# Altium schematic sheet mechanics.SchDoc: Stabilizer Piezo Driver
size 420 x 297 mm; CheckedBy: G. Kasprowicz; Author: Jakub Kajzer; CompanyName: WUT ISE; DrawnBy: Jakub Kajzer; Organization: WUT ISE; Address1: PW ISE; Address2: Nowowiejska 15/19 00-665 Warsaw; Address3: gkasprow@gmail.com; DocumentNumber: 7; Revision: 2; SheetNumber: 7; SheetTotal: 7; ModifiedBy: -; CreateDate: 03.08.2020; CheckedDate: -; Title2: mechanics; DivGrp: WUT ISE; Designer: Jakub Kajzer; ModifiedDate: -; ProjectName: Sensor Box
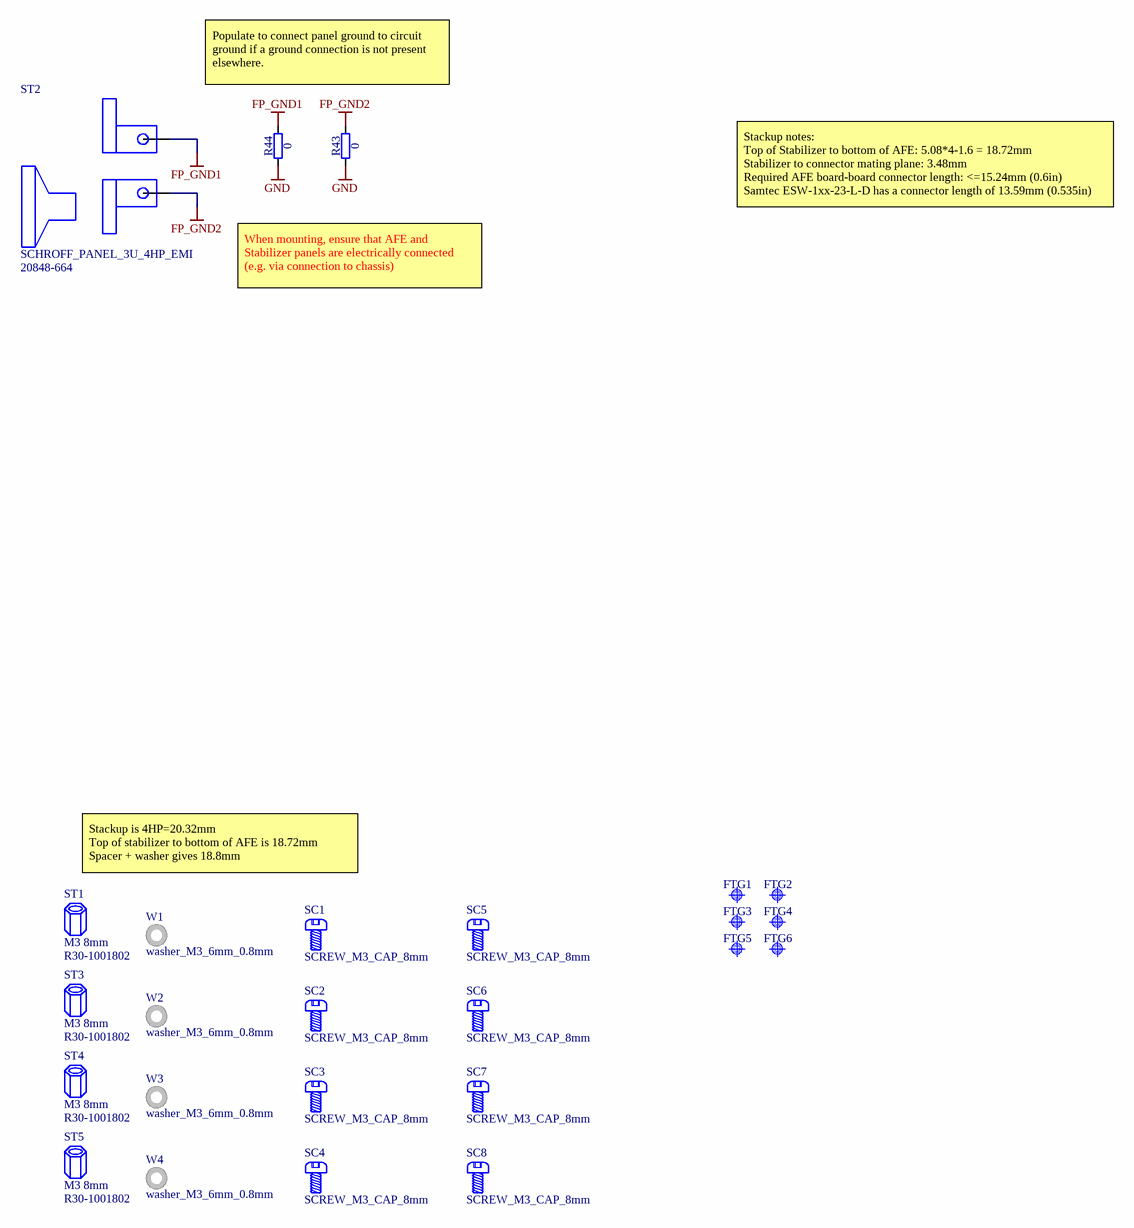
[diagram p0: mechanics.SchDoc]

## Parts
FTG1  Use only in PCB  [FIDUCIAL_TOP_C100-200]  (value not drawn)
FTG2  Use only in PCB  [FIDUCIAL_TOP_C100-200]  (value not drawn)
FTG3  Use only in PCB  [FIDUCIAL_TOP_C100-200]  (value not drawn)
FTG4  Use only in PCB  [FIDUCIAL_TOP_C100-200]  (value not drawn)
FTG5  Use only in PCB  [FIDUCIAL_TOP_C100-200]  (value not drawn)
FTG6  Use only in PCB  [FIDUCIAL_TOP_C100-200]  (value not drawn)
R43  0  [RESC1608X55N]
R44  0  [RESC1608X55N]
SC1  SCREW_M3_CAP_8mm  [SCREW_M3_CAP_8mm]
SC2  SCREW_M3_CAP_8mm  [SCREW_M3_CAP_8mm]
SC3  SCREW_M3_CAP_8mm  [SCREW_M3_CAP_8mm]
SC4  SCREW_M3_CAP_8mm  [SCREW_M3_CAP_8mm]
SC5  SCREW_M3_CAP_8mm  [SCREW_M3_CAP_8mm]
SC6  SCREW_M3_CAP_8mm  [SCREW_M3_CAP_8mm]
SC7  SCREW_M3_CAP_8mm  [SCREW_M3_CAP_8mm]
SC8  SCREW_M3_CAP_8mm  [SCREW_M3_CAP_8mm]
ST1  M3 8mm  [R30-1001802]
ST2  SCHROFF_PANEL_3U_4HP_EMI  Manufacturer Part Number: 20848-664  [SCHROFF_PANEL_3HP_4U]
ST3  M3 8mm  [R30-1001802]
ST4  M3 8mm  [R30-1001802]
ST5  M3 8mm  [R30-1001802]
W1  washer_M3_6mm_0.8mm  [washer_M3_6mm_0.8mm]
W2  washer_M3_6mm_0.8mm  [washer_M3_6mm_0.8mm]
W3  washer_M3_6mm_0.8mm  [washer_M3_6mm_0.8mm]
W4  washer_M3_6mm_0.8mm  [washer_M3_6mm_0.8mm]

## Nets
FP_GND1: R44.2 ST2.1
FP_GND2: R43.2 ST2.0
GND: R43.1 R44.1

## Notes on the sheet
- Populate to connect panel ground to circuit ground if a ground connection is not present elsewhere.
- Stackup notes:
  Top of Stabilizer to bottom of AFE: 5.08*4-1.6 = 18.72mm
  Stabilizer to connector mating plane: 3.48mm
  Required AFE board-board connector length: <=15.24mm (0.6in)
  Samtec ESW-1xx-23-L-D has a connector length of 13.59mm (0.535in)
- When mounting, ensure that AFE and Stabilizer panels are electrically connected (e.g. via connection to chassis)
- Stackup is 4HP=20.32mm
  Top of stabilizer to bottom of AFE is 18.72mm
  Spacer + washer gives 18.8mm
- Project/Equipment
- Document
- Designer
- Drawn by
- Check.by
- Copyright WUT ISE 2018.
  This documentation describes Open Hardware and is licensed under the CERN OHL v.1.1. You may redistribute and modify this documentation under the terms of the CERN OHL v.1.1. (http://ohwr.org/CERNOHL). This documentation is distributed WITHOUT ANY EXPRESS OR IMPLIED WARRANTY, INCLUDING OF MERCHANTABILITY, SATISFACTORY QUALITY AND FITNESS FOR A PARTICULAR PURPOSE. Please see the CERN OHL v.1.1 for applicable conditions.
- Contact
- File
- Last Mod.
- Print Date
- Sheet
- Size
- A3
- of
- Rev

## Library data of the parts
FTG1-FTG6 = FIDUCIAL_TARGET_C100-200: Fiducial Target; Part Description: Round Fiducial Target, Top Layer, 1.0mm, Top Solder 2.0mm, Keepout =2.0mm; Mounted: No; Part Number: FIDUCIAL_TARGET_C100-200; Component Kind: Standard (No BOM); Component Type: Standard (No BOM); Pin Count: 1; Family: Fiducial; Socket: No; SMD: Yes; Sense: No; Status: None; ComponentHeight: 0mm; HelpURL: Undefined; Author: CERN DEM JLC; CreateDate: 09/02/2010; LatestRevisionDate: 04/04/2012; PackageDescription: Round Fiducial Target, Top Layer, 1.0mm, Top Solder 2.0mm, Keepout =2.0mm
R43 R44 = R0603_0R_JUMPER: Resistor; Part Description: 1A (0.05R Max DC Resistance) Zero Ohm Jumper; Manufacturer: GENERIC; Manufacturer1 Part Number: NRC06Z0; PressFit: No; Part Number: R0603_0R_JUMPER; Component Kind: Standard; Component Type: Standard; Pin Count: 2; Value: 0; Status: Preferred; Manufacturer Part Number: R0603_0R_JUMPER; Case: 0603; Mounted: Yes; Sense: No; Socket: No; SMD: Yes; Manufacturer1 Example: NIC COMPONENT; Manufacturer1 ComponentHeight: 0.55mm; HelpURL: \\cern.ch\dfs\Applications\Altium\Datasheets\R0603_NIC_NRC.pdf; Author: CERN DEM JLC; CreateDate: 03/12/2007; LatestRevisionDate: 13/03/2008
SC1-SC8 = SCREW_M3_CAP_8mm: M3 x 8mm cap head screw; Manufacturer: Accu Limited; Manufacturer Part Number: SSCF-M3-8-12.9-Z
ST1 ST3-ST5 = STANDOFF_HARWIN_R30_1001802: M3.0x18 standoff; Manufacturer: Harwin; Manufacturer Part Number: R30-1001802
ST2 = SCHROFF_PANEL_3U_4HP_EMI: Schroff 3HP 4U EUROCARD Panel with EMI gaskets kit; Manufacturer: Schroff
W1-W4 = washer_M3_6mm_0.8mm: M3 Washer: / ID: 3.2mm / OD: 6mm / Thickness 0.8mm; Manufacturer: Accu Limited; Manufacturer Part Number: HAFZ-M3-A4